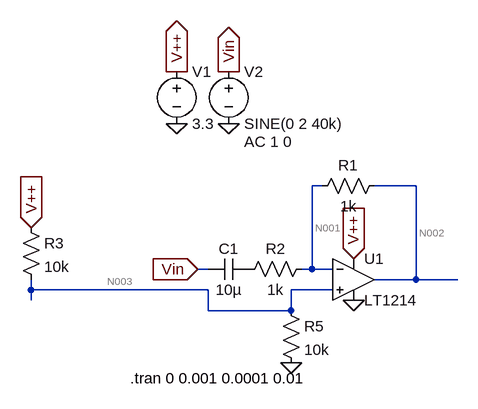
[diagram p0: schematic Draft1.asc]
Draft1.asc, the LTspice schematic file:
Version 4
SHEET 1 880 680
WIRE 352 192 336 192
WIRE 496 192 432 192
WIRE 176 320 160 320
WIRE 336 320 336 192
WIRE 336 320 320 320
WIRE 368 320 336 320
WIRE 496 336 496 192
WIRE 496 336 432 336
WIRE 560 336 496 336
WIRE -96 352 -96 336
WIRE 176 352 -96 352
WIRE 368 352 304 352
WIRE -96 368 -96 352
WIRE 176 384 176 352
WIRE 304 384 304 352
WIRE 304 384 176 384
FLAG 128 96 0
FLAG 208 96 0
FLAG 128 16 V++
IOPIN 128 16 Out
FLAG 208 16 Vin
IOPIN 208 16 Out
FLAG 400 368 0
FLAG 160 320 Vin
IOPIN 160 320 In
FLAG 304 464 0
FLAG 400 304 V++
IOPIN 400 304 In
FLAG -96 256 V++
IOPIN -96 256 In
SYMBOL voltage 128 0 R0
WINDOW 123 0 0 Left 0
WINDOW 39 0 0 Left 0
SYMATTR InstName V1
SYMATTR Value 3.3
SYMBOL voltage 208 0 R0
WINDOW 123 24 124 Left 2
WINDOW 39 0 0 Left 0
SYMATTR InstName V2
SYMATTR Value SINE(0 2 40k)
SYMATTR Value2 AC 1 0
SYMBOL OpAmps\\LT1214 400 272 R0
SYMATTR InstName U1
SYMBOL res 448 176 R90
WINDOW 0 0 56 VBottom 2
WINDOW 3 32 56 VTop 2
SYMATTR InstName R1
SYMATTR Value 1k
SYMBOL res 336 304 R90
WINDOW 0 0 56 VBottom 2
WINDOW 3 32 56 VTop 2
SYMATTR InstName R2
SYMATTR Value 1k
SYMBOL res -112 240 R0
SYMATTR InstName R3
SYMATTR Value 10k
SYMBOL res 288 368 R0
SYMATTR InstName R5
SYMATTR Value 10k
SYMBOL cap 240 304 R90
WINDOW 0 0 32 VBottom 2
WINDOW 3 32 32 VTop 2
SYMATTR InstName C1
SYMATTR Value 10µ
TEXT 56 488 Left 2 !.tran 0 0.001 0.0001 0.01

The netlist it stands for:
* Draft1.asc
V1 V++ 0 3.3
V2 Vin 0 SINE(0 2 40k) AC 1 0
XU1 N003 N001 V++ 0 N002 LT1213  ; LT1214, pins In+ In- V+ V- OUT
R1 N002 N001 1k
R2 N001 P001 1k
R3 V++ N003 10k
R5 N003 0 10k
C1 P001 Vin 10µ
.tran 0 0.001 0.0001 0.01
.lib LTC.lib
.backanno
.end

* Results of the author's LTspice run, read from the files saved beside the schematic
* Operating Point, zero values left out:
*   V(v++) = 3.3 V
*   V(n001) = 1.65 V
*   V(n003) = 1.65 V
*   V(n002) = 1.65 V
*   V(p001) = 1.65 V
*   I(R5) = 165 µA
*   I(R3) = 165 µA
*   I(R1) = -80 nA
*   I(V1) = -2.737 mA
*   Ix(u1:1) = -80 nA
*   Ix(u1:2) = -80 nA
*   Ix(u1:3) = 2.572 mA
*   Ix(u1:4) = -2.572 mA
*   Ix(u1:5) = 80 nA